# Altium schematic sheet 把手指纹锁2020926.SchDoc
size A2
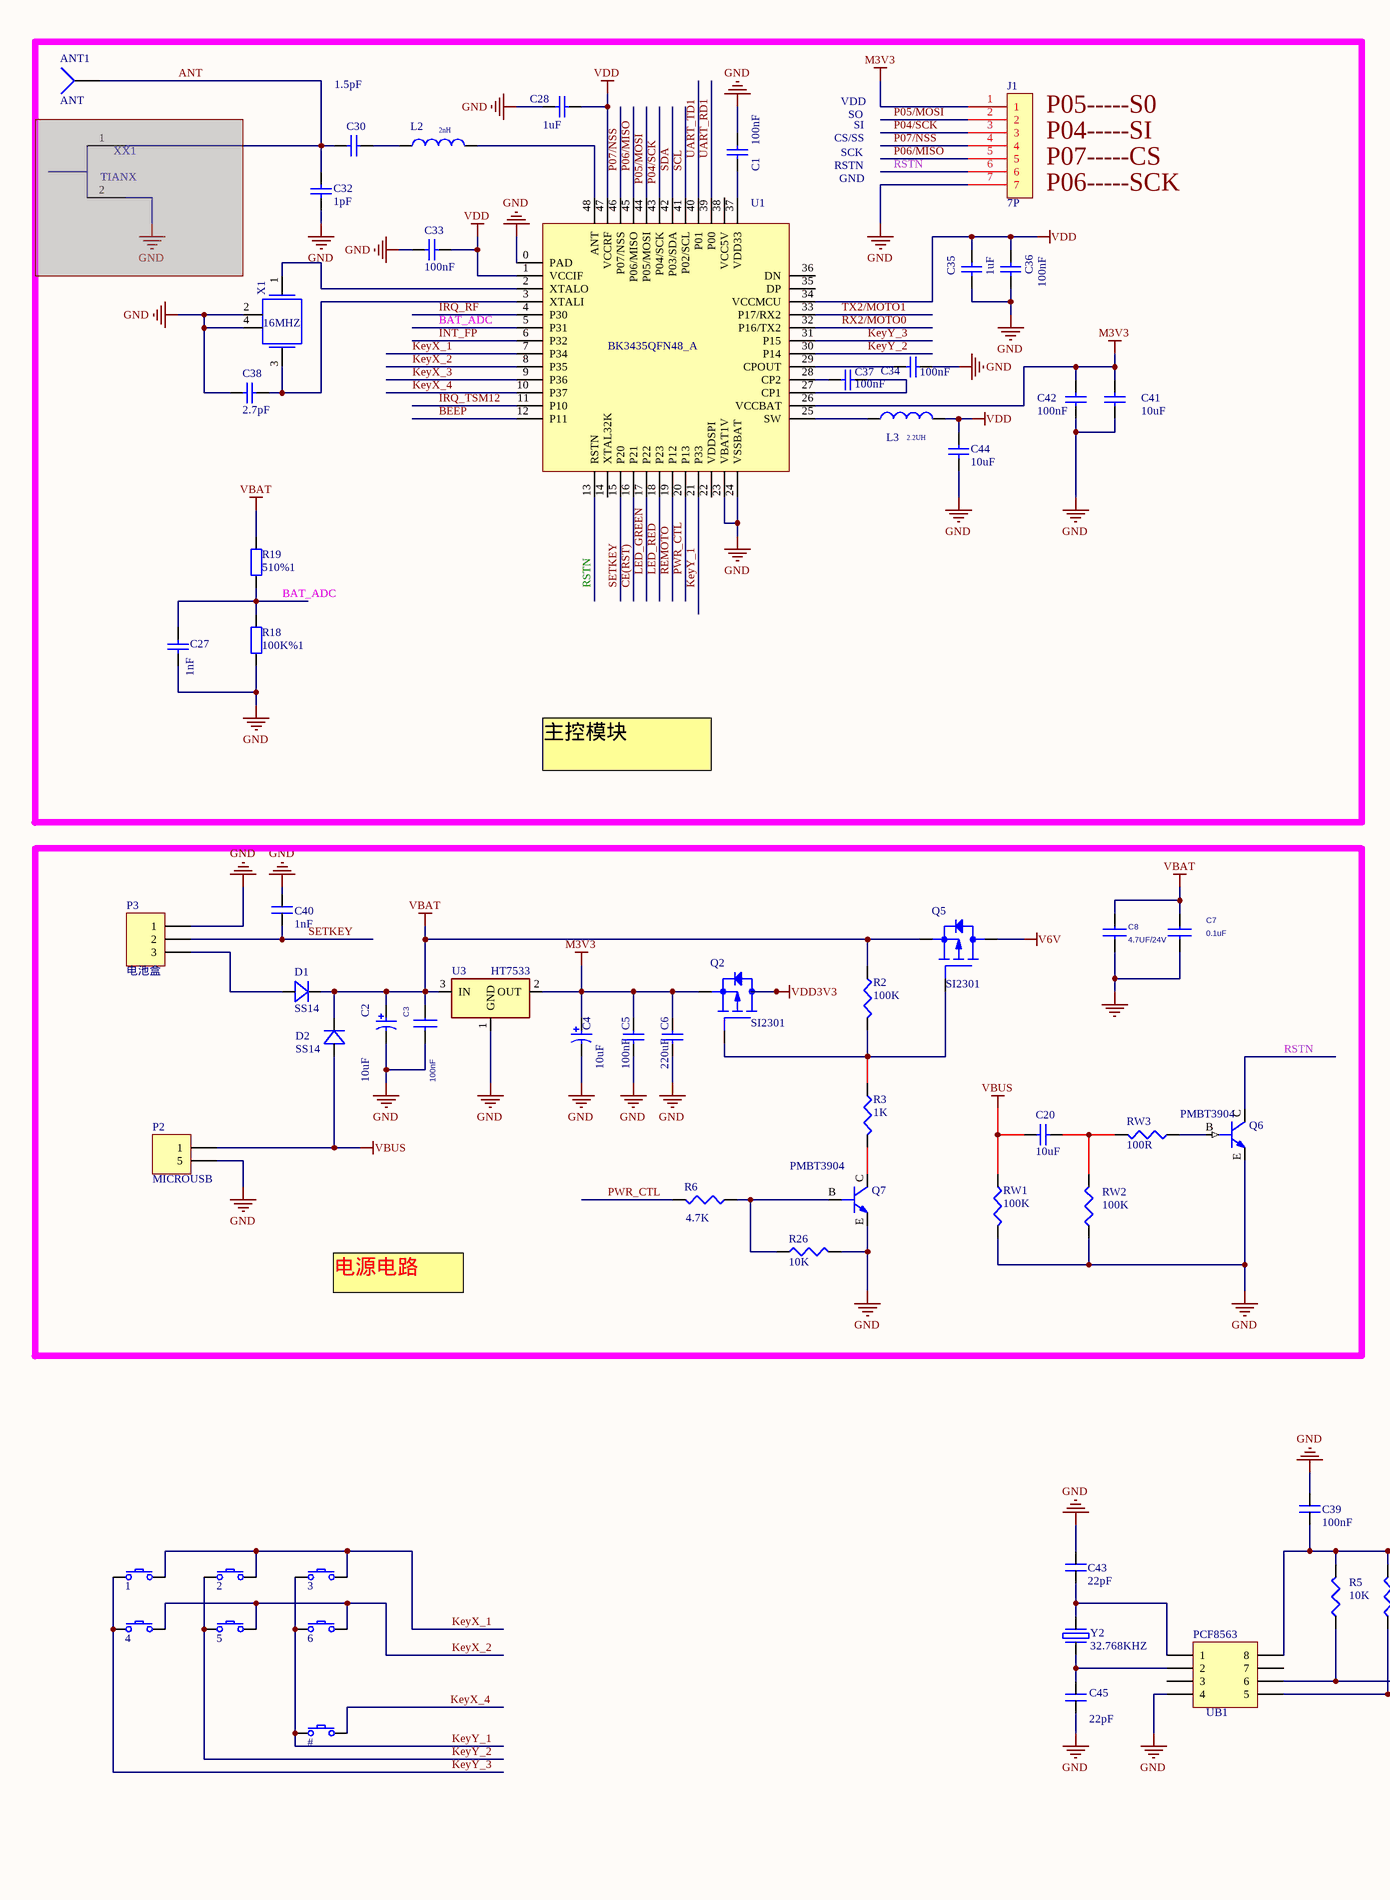
[diagram p0: 把手指纹锁2020926.SchDoc, left]
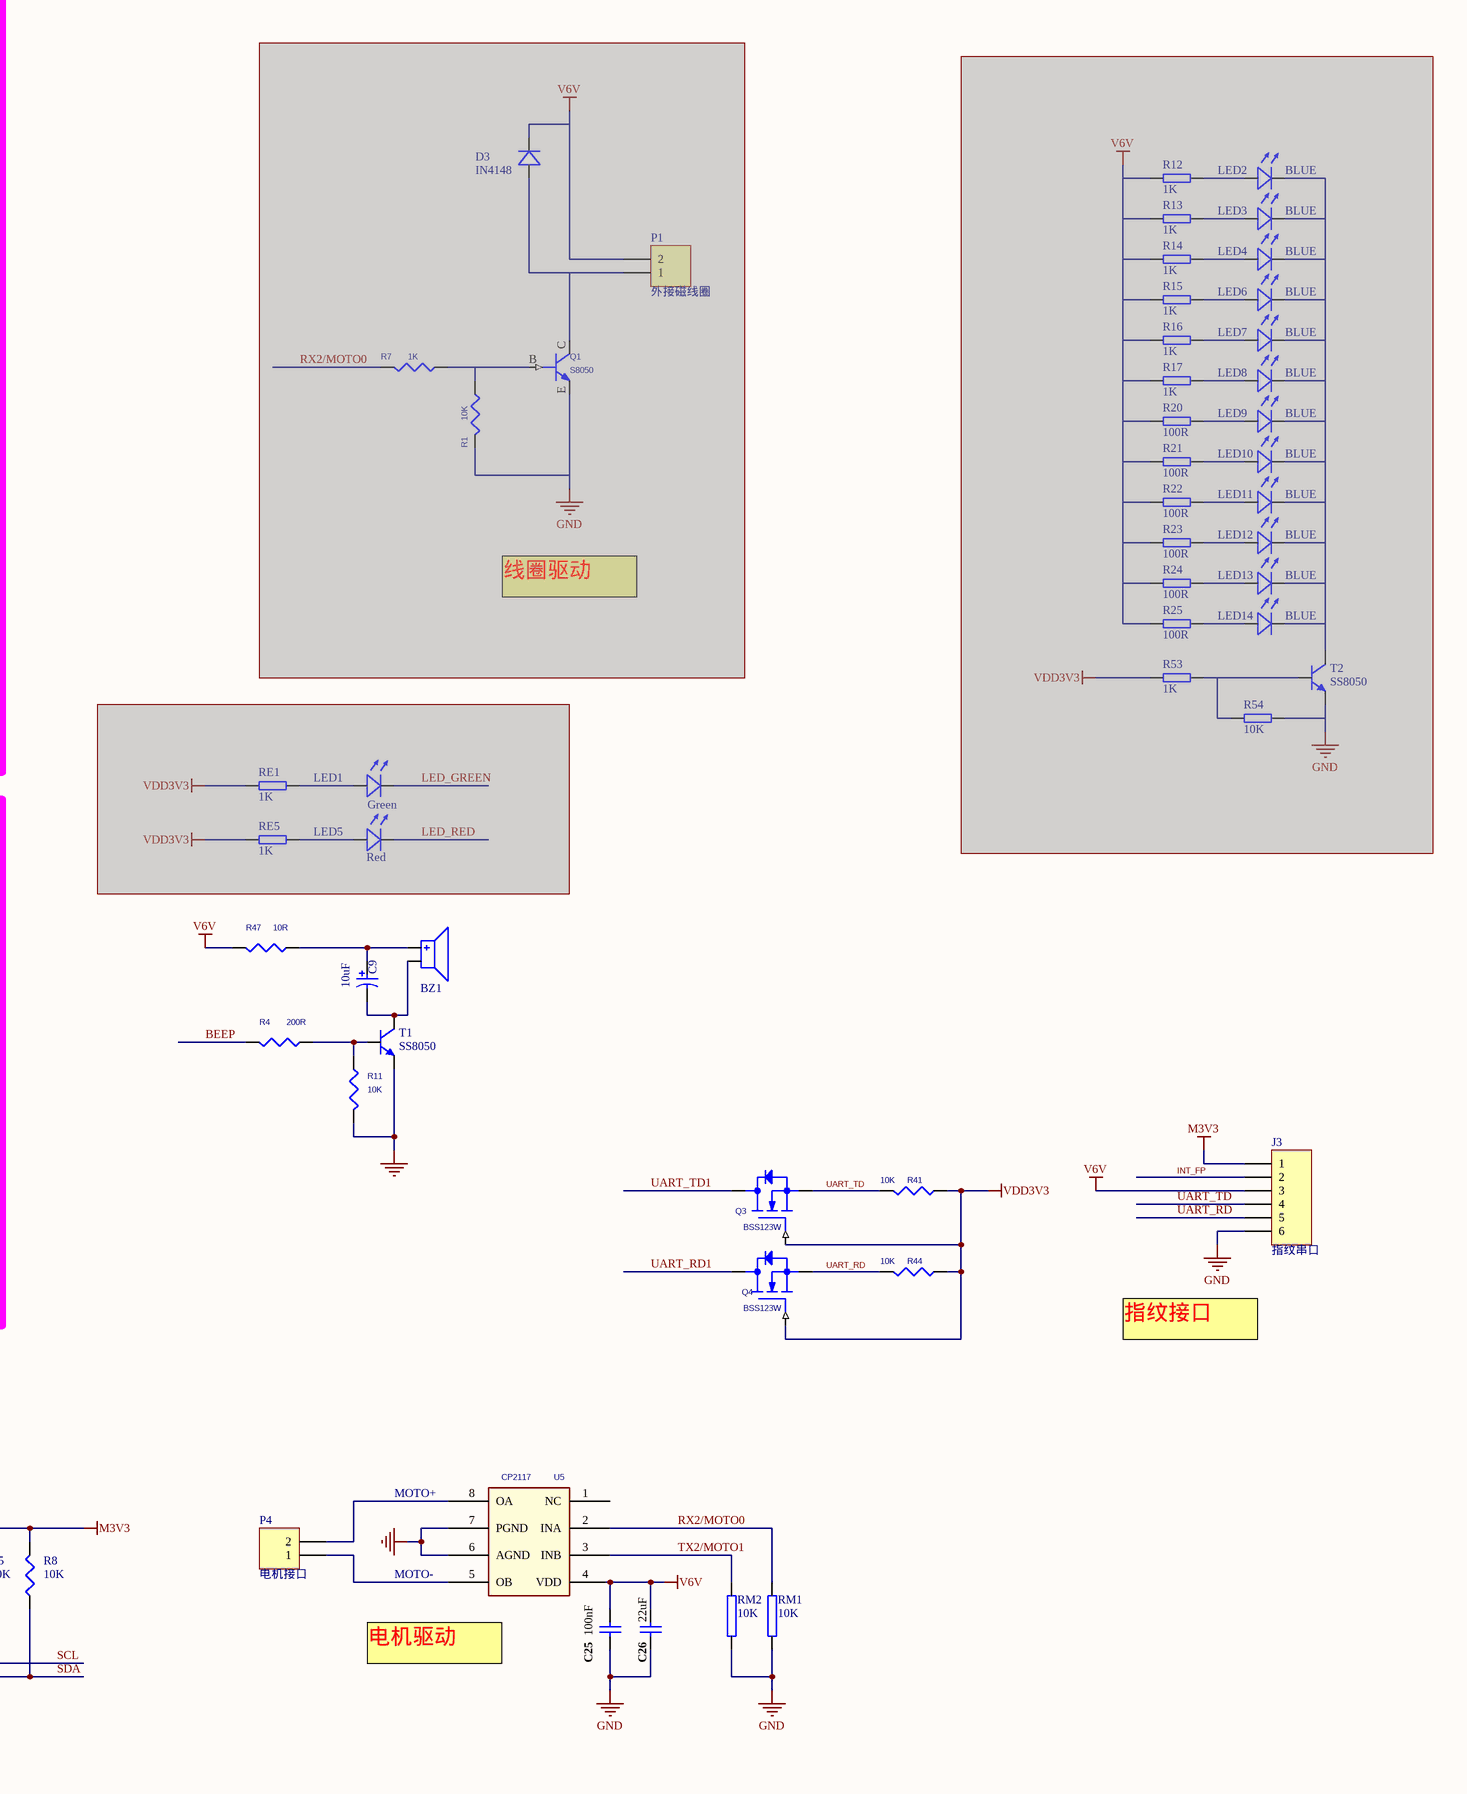
[diagram p1: 把手指纹锁2020926.SchDoc, right]

## Parts
1  SW  [KEY_5.2*3.7*6.4]  (value not drawn)
2  SW  [KEY_5.2*3.7*6.4]  (value not drawn)
3  SW  [KEY_5.2*3.7*6.4]  (value not drawn)
4  SW  [KEY_5.2*3.7*6.4]  (value not drawn)
5  SW  [KEY_5.2*3.7*6.4]  (value not drawn)
6  SW  [KEY_5.2*3.7*6.4]  (value not drawn)
#  SW  [KEY_5.2*3.7*6.4]  (value not drawn)
ANT1  ANT  [ANT_mark]
BZ1  BUZZER  [BUZZER_D93_L40]  (value not drawn)
C1  100nF  [0402C]
C2  10uF  [0805C]
C3  100nF  [0402C]
C4  10uF  [0805C]
C5  100nF  [0402C]
C6  220uF  [R5*5.8]
C7  0.1uF  [0603C]
C8  4.7UF/24V  [0805C]
C9  10uF  [0603C]
C20  10uF  [0603C]
C25  100nF  [0402C]
C26  22uF  [0805C]
C27  1nF  [0402C]
C28  1uF  [0402C]
C30  1.5pF  [0603C]
C32  1pF  [0603C]
C33  100nF  [0402C]
C34  100nF  [0402C]
C35  1uF  [0402C]
C36  100nF  [0402C]
C37  100nF  [0402C]
C38  2.7pF  [0402C]
C39  100nF  [0402C]
C40  1nF  [0402C]
C41  10uF  [0603C]
C42  100nF  [0402C]
C43  22pF  [0402C]
C44  10uF  [0402C]
C45  22pF  [0402C]
D1  SS14  [DO-214AA]
D2  SS14  [DO-214AA]
D3  IN4148  [SOD-123]  (masked out: inside a compile mask, not in the netlist)
J1  7P  [7P-2.0MM]
J3  指纹串口  [SM06B-SRSS-TB]
L2  2nH  [0603L]
L3  2.2UH  [0603L]
LED1  Green  [0603LED]  (masked out: inside a compile mask, not in the netlist)
LED2  BLUE  [0603LED]  (masked out: inside a compile mask, not in the netlist)
LED3  BLUE  [0603LED]  (masked out: inside a compile mask, not in the netlist)
LED4  BLUE  [0603LED]  (masked out: inside a compile mask, not in the netlist)
LED5  Red  [0603LED]  (masked out: inside a compile mask, not in the netlist)
LED6  BLUE  [0603LED]  (masked out: inside a compile mask, not in the netlist)
LED7  BLUE  [0603LED]  (masked out: inside a compile mask, not in the netlist)
LED8  BLUE  [0603LED]  (masked out: inside a compile mask, not in the netlist)
LED9  BLUE  [0603LED]  (masked out: inside a compile mask, not in the netlist)
LED10  BLUE  [0603LED]  (masked out: inside a compile mask, not in the netlist)
LED11  BLUE  [0603LED]  (masked out: inside a compile mask, not in the netlist)
LED12  BLUE  [0603LED]  (masked out: inside a compile mask, not in the netlist)
LED13  BLUE  [0603LED]  (masked out: inside a compile mask, not in the netlist)
LED14  BLUE  [0603LED]  (masked out: inside a compile mask, not in the netlist)
P1  外接磁线圈  [B2B-PH]  (masked out: inside a compile mask, not in the netlist)
P2  MICROUSB  [MICRO-USB_F-B]
P3  电池盒  [3P-1.8MM]
P4  电机接口  [S2B-PH-SM3-TB]
Q1  S8050  [SOT-23 - BCE]  (masked out: inside a compile mask, not in the netlist)
Q2  SI2301  [SOT-23 - GDS]
Q3  BSS123W  [SOT-23 - GDS]
Q4  BSS123W  [SOT-23 - GDS]
Q5  SI2301  [SOT-23 - GDS]
Q6  PMBT3904  [SOT-23 - BCE]
Q7  PMBT3904  [SOT-23 - BCE]
R1  10K  [0402R]  (masked out: inside a compile mask, not in the netlist)
R2  100K  [0402R]
R3  1K  [0402R]
R4  200R  [0402R]
R5  10K  [0402R]
R6  4.7K  [0402R]
R7  1K  [0402R]  (masked out: inside a compile mask, not in the netlist)
R8  10K  [0402R]
R11  10K  [0402R]
R12  1K  [0402R]  (masked out: inside a compile mask, not in the netlist)
R13  1K  [0402R]  (masked out: inside a compile mask, not in the netlist)
R14  1K  [0402R]  (masked out: inside a compile mask, not in the netlist)
R15  1K  [0402R]  (masked out: inside a compile mask, not in the netlist)
R16  1K  [0402R]  (masked out: inside a compile mask, not in the netlist)
R17  1K  [0402R]  (masked out: inside a compile mask, not in the netlist)
R18  100K%1  [0402R]
R19  510%1  [0402R]
R20  100R  [0402R]  (masked out: inside a compile mask, not in the netlist)
R21  100R  [0402R]  (masked out: inside a compile mask, not in the netlist)
R22  100R  [0402R]  (masked out: inside a compile mask, not in the netlist)
R23  100R  [0402R]  (masked out: inside a compile mask, not in the netlist)
R24  100R  [0402R]  (masked out: inside a compile mask, not in the netlist)
R25  100R  [0402R]  (masked out: inside a compile mask, not in the netlist)
R26  10K  [0402R]
R41  10K  [0402R]
R44  10K  [0402R]
R47  10R  [0402R]
R53  1K  [0402R]  (masked out: inside a compile mask, not in the netlist)
R54  10K  [0402R]  (masked out: inside a compile mask, not in the netlist)
RE1  1K  [0402R]  (masked out: inside a compile mask, not in the netlist)
RE5  1K  [0402R]  (masked out: inside a compile mask, not in the netlist)
RM1  10K  [0402R]
RM2  10K  [0402R]
RW1  100K  [0402R]
RW2  100K  [0402R]
RW3  100R  [0402R]
T1  SS8050  [SOT-23-3L]
T2  SS8050  [SOT-23-3L]  (masked out: inside a compile mask, not in the netlist)
U1  BK3435QFN48_A  [QFN48_6*6*0.4]
U3  HT7533  [SOT-23-3L]
U5  CP2117  [SOP8]
UB1  PCF8563  [SOP8]
X1  16MHZ  [XTAL3225]
XX1  TIANX  [BT_NAMI_1]
Y2  32.768KHZ  [晶振-9]

## Nets
GND: C1.2 C2.2 C3.2 C4.2 C5.2 C6.2 C7.2 C8.2 C25.2 C26.2 C27.1 C28.1 C32.1 C33.1 C34.2 C35.1 C36.1 C38.1 C39.2 C40.2 C41.2 C42.2 C43.2 C44.1 C45.1 J1.7 J3.6 P2.5 P3.1 Q6.E(EMITTER) Q7.E(EMITTER) R11.2 R18.2 R26.2 RM1.1 RM2.1 RW1.2 RW2.1 T1.2 U1.0(PAD) U1.23(VBAT1V) U1.24(VSSBAT) U3.1(GND) U5.6(AGND) U5.7(PGND) UB1.4 X1.2 X1.4
M3V3: C4.1 C5.1 C6.1 C39.1 C41.1 C42.1 J1.1 J3.1 Q2.S(SOURCE) R5.2 R8.2 U1.26(VCCBAT) U3.2(OUT) UB1.8
V6V: C25.1 C26.1 J3.3 Q5.D(DRAIN) R47.2 U5.4(VDD)
VBAT: C2.1 C3.1 C7.1 C8.1 D1.2(K) D2.2(K) Q5.S(SOURCE) R2.1 R19.1 U3.3(IN)
VBUS: C20.1 D2.1(A) P2.1 RW1.1
VDD: C28.2 C33.2 C35.2 C36.2 C44.2 L3.2(P2) U1.1(VCCIF) U1.34(VCCMCU) U1.47(VCCRF)
VDD3V3: Q2.D(DRAIN) Q3.G(GATE) Q4.G(GATE) R41.2 R44.2
ANT: ANT1.1 C30.2 C32.2 XX1.1
BAT_ADC: C27.2 R18.1 R19.2 U1.5(P31)
BEEP: R4.2 U1.12(P11)
CE(RST): U1.16(P21)
INT_FP: J3.2 U1.6(P32)
IRQ_RF: U1.4(P30)
IRQ_TSM12: U1.11(P10)
KeyX_1: 1.2 2.2 3.2 U1.7(P34)
KeyX_2: 4.2 5.2 6.2 U1.8(P35)
KeyX_3: U1.9(P36)
KeyX_4: #.2 U1.10(P37)
KeyY_1: 3.1 6.1 #.1 U1.21(P33)
KeyY_2: 2.1 5.1 U1.30(P14)
KeyY_3: 1.1 4.1 U1.31(P15)
LED_GREEN: U1.17(P22)
LED_RED: U1.18(P23)
MOTO+: P4.2 U5.8(OA)
MOTO-: P4.1 U5.5(OB)
P04/SCK: J1.3 U1.43(P04/SCK)
P05/MOSI: J1.2 U1.44(P05/MOSI)
P06/MISO: J1.5 U1.45(P06/MISO)
P07/NSS: J1.4 U1.46(P07/NSS)
PWR_CTL: R6.2 U1.20(P13)
REMOTO: U1.19(P12)
RSTN: J1.6 Q6.C(COLLECTOR) U1.13(RSTN)
RX2/MOTO0: RM1.2 U1.32(P16/TX2) U5.2(INA)
SCL: R5.1 U1.41(P02/SCL) UB1.6
SDA: R8.1 U1.42(P03/SDA) UB1.5
SETKEY: C40.1 P3.2 U1.15(P20)
TX2/MOTO1: RM2.2 U1.33(P17/RX2) U5.3(INB)
UART_RD: J3.5 Q4.S(SOURCE) R44.1
UART_RD1: Q4.D(DRAIN) U1.39(P00)
UART_TD: J3.4 Q3.S(SOURCE) R41.1
UART_TD1: Q3.D(DRAIN) U1.40(P01)
NetBZ1_1: BZ1.1 C9.1 R47.1
NetBZ1_2: BZ1.2 C9.2 T1.3
NetC1_1: C1.1 U1.37(VDD33)
NetC20_2: C20.2 RW2.2 RW3.2
NetC30_1: C30.1 L2.1(P1)
NetC34_1: C34.1 U1.29(CPOUT)
NetC37_1: C37.1 U1.28(CP2)
NetC37_2: C37.2 U1.27(CP1)
NetC38_2: C38.2 U1.3(XTALI) X1.3
NetC43_1: C43.1 UB1.1 Y2.1
NetC45_2: C45.2 UB1.2 Y2.2
NetD1_1: D1.1(A) P3.3
NetL2_2: L2.2(P2) U1.48(ANT)
NetL3_1: L3.1(P1) U1.25(SW)
NetQ2_G: Q2.G(GATE) Q5.G(GATE) R2.2 R3.1
NetQ6_B: Q6.B(BASE) RW3.1
NetQ7_B: Q7.B(BASE) R6.1 R26.1
NetQ7_C: Q7.C(COLLECTOR) R3.2
NetR4_1: R4.1 R11.1 T1.1
NetU1_2: U1.2(XTALO) X1.1

Not connected (* = marked no-connect by the designer): U1 14(XTAL32K) 22(VDDSPI) 35(DP) 36(DN) 38(VCC5V); U5 1(NC); UB1 3 7; XX1 2

## Notes on the sheet
- VDD
- RSTN
- CS/SS
- SCK
- SO
- SI
- (near J1) P04-----SI
- (near J1) P05-----S0
- (near J1) P07-----CS
- GND
- (near J1) P06-----SCK
- 线圈驱动
- 主控模块
- 背光灯
- 电源电路
- 指纹接口
- (near U5) 电机驱动
- 轻触按键
- 时钟电路

## Library data of the parts
1-6 # = SW: Switch
ANT1 = Socket: LatestRevisionDate: 17-Jul-2002; LatestRevisionNote: Re-released for DXP Platform.; Publisher: Altium Limited
C1 C28 C30 C32-C38 C41 C42 C44 = Cap: Capacitor; Value: 10pF; Published: 8-Jun-2000; LatestRevisionDate: 17-Jul-2002; LatestRevisionNote: Re-released for DXP Platform.; PackageReference: RAD-0.3; Publisher: Altium Limited; PackageDescription: Radial Cap, Thru-Hole; 2 Leads; 0.3 in Pin Spacing
C2 C4 C9 = CAP-P: Capacitor, tolerance ±20%
C3 C7 C8 = CAP NP
C5 C6 C20 C25-C27 = CAP-NP: Capacitor, Ceramic; Capacitance: 18 pF; Dielectric: COG; Polarity: Non-Polarized; Rated Voltage: 50 mV; Tolerance: 5 %; Category: Capacitor; Mounting Technology: Surface Mount; Status: Unreleased; Technology: Ceramic
C39 C40 C43 C45 = C
D1-D3 = D
J3 = Header 6: Header, 6-Pin; LatestRevisionDate: 17-Jul-2002; LatestRevisionNote: Re-released for DXP Platform.; Publisher: Altium Limited
L2 L3 = INDUCTOR: Power Inductor, 4.7uH, 0.7A, 260mR DCR; XMOS Part Number: E-09-0011; Manufacturer: Taiyo Yuden; Manufacturer Part Number: CBC2518T4R7M; Part Creator: JG; LEVEL: STD; DEVICE: L; FORWARD_PCB: 1; Tolerance (%): 20; Max DC Resistance: 0.26R; Rated Current (Saturation): 0.68A; Rated Current (Temp Rise): 0.92A; Approx Volume Cost ($): 0.07; Approved: NO; VALUE: 2.0nH; Datasheet: http://www.yuden.co.jp/us/product/pdf/ecb2_e.pdf; Max Height (mm): 2; Digikey Link: http://search.digikey.com/scripts/DkSearch/dksus.dll?lang=en&site=US&keywords=CBC2518T4R7M
LED1-LED14 = LED
P1 = Header 2: Header, 2-Pin; LatestRevisionDate: 17-Jul-2002; LatestRevisionNote: Re-released for DXP Platform.; Publisher: Altium Limited
P2 P4 = MHDR1X2: Header, 2-Pin; LatestRevisionDate: 17-Jul-2002; LatestRevisionNote: Re-released for DXP Platform.; Publisher: Altium Limited
P3 = Header 3: Header, 3-Pin; LatestRevisionDate: 17-Jul-2002; LatestRevisionNote: Re-released for DXP Platform.; Publisher: Altium Limited
Q1 = PMBT3904_Dup1: OriginalSymbolOrigin: (0,0); ROOM: power
Q2 Q5 = PWRMOSFET_EP_DGS_0
Q3 Q4 = BSS123L_0
R1 R7 R41 R44 = RES
R2 R3 R5 R6 R8 R12-R17 R20-R26 R53 R54 RE1 RE5 RW1-RW3 = R
R4 R11 R47 = R_Dup1
R18 R19 = Res2: Resistor; Value: 470K; Published: 2013年12月24日; LatestRevisionDate: 2013年12月24日; LatestRevisionNote: Re-released for DXP Platform.
RM1 RM2 = Pro71C3.TMP_UnNamed_1
T1 T2 = NPN_BJT: Bipolar Junction Transistor
U1 = EFR32BG1-QFN48
U3 = XC6206P302M
U5 = AM24LC02_0
UB1 = IC8
X1 = OSC: XMOS Part Number: E-07-0030; Manufacturer: Abracon; Manufacturer Part Number: ABLS-24.000MHz-B4; Part Creator: JG; LEVEL: STD; DEVICE: X; FORWARD_PCB: 1; Approx Volume Cost ($): 0.15; Approved: NO; VALUE: ABLS; FREQUENCY: 38.4MHZ; Datasheet: http://www.abracon.com/Resonators/abls.pdf; Max Height (mm): 4.2; Supplier Link: http://search.digikey.com/scripts/DkSearch/dksus.dll?lang=en&site=US&keywords=ABLS-24.000MHz-B4
Y2 = 晶振